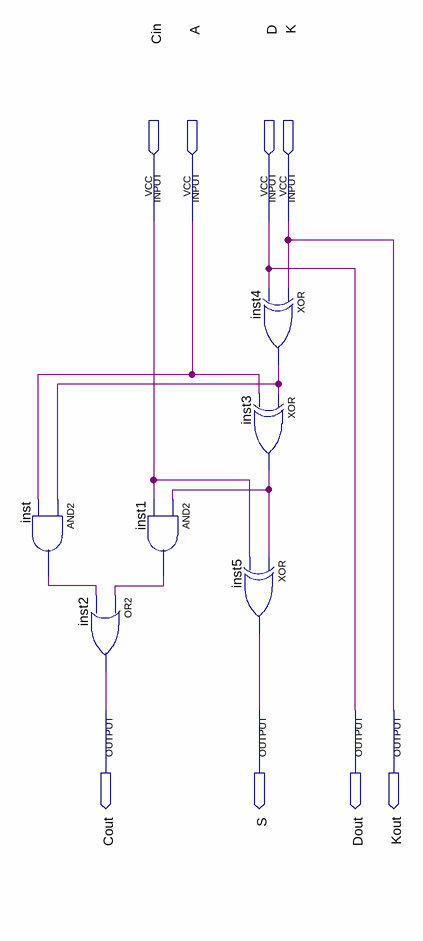
[diagram p0: schematic sheet]
// Quartus schematic Div_cell.bdf as structural Verilog: 6 symbols, 8 pins
module Div_cell (
  input  Cin,
  input  A,
  input  D,
  input  K,
  output Cout,
  output S,
  output Dout,
  output Kout
);

  wire inst1_out, inst3_out, inst4_out, inst_out;

  and inst (inst_out, inst4_out, A);
  or inst2 (Cout, inst1_out, inst_out);
  and inst1 (inst1_out, inst3_out, Cin);
  xor inst4 (inst4_out, K, D);
  xor inst3 (inst3_out, inst4_out, A);
  xor inst5 (S, inst3_out, Cin);

  assign Dout = D;
  assign Kout = K;
endmodule
